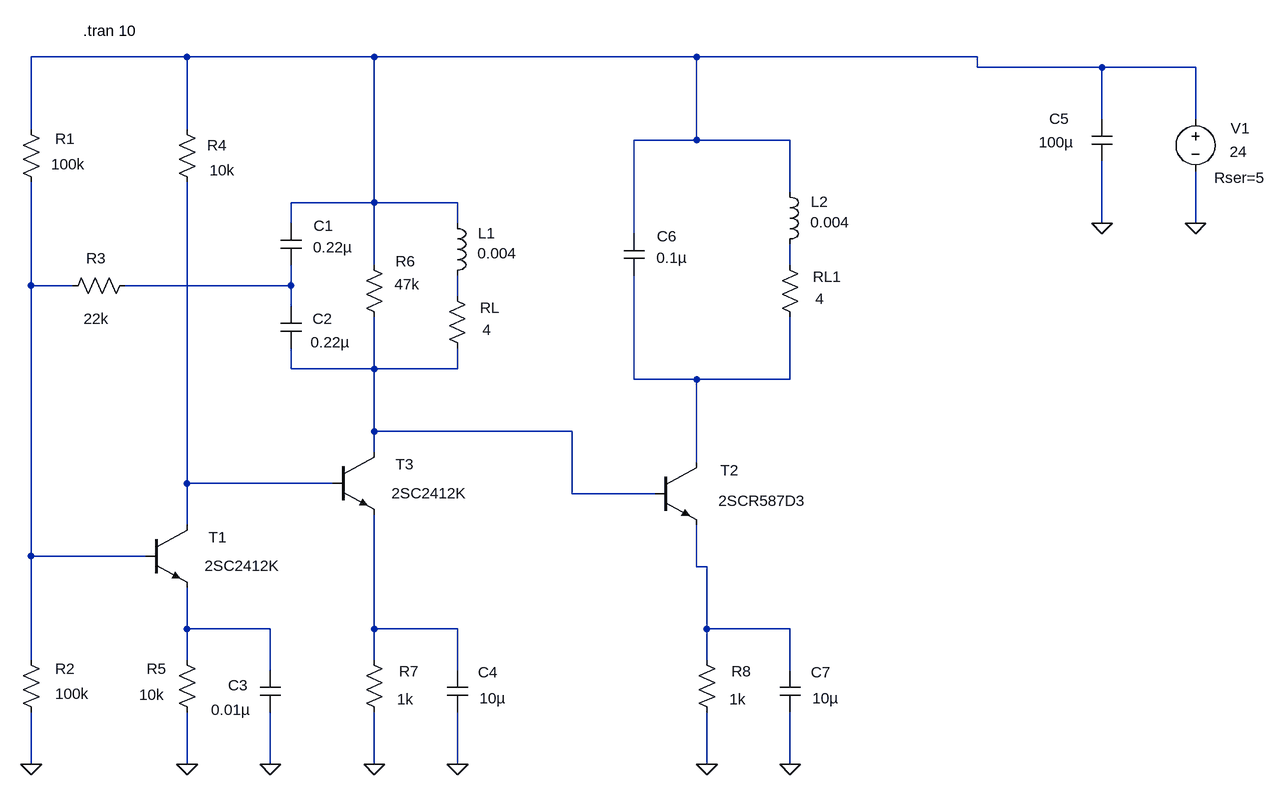
[diagram p0: schematic LC_OscillatorCapsFeedback2.asc]
LC_OscillatorCapsFeedback2.asc, the LTspice schematic file:
Version 4
SHEET 1 1236 820
WIRE -432 -288 -672 -288
WIRE -144 -288 -432 -288
WIRE 352 -288 -144 -288
WIRE 784 -288 352 -288
WIRE 784 -272 784 -288
WIRE 976 -272 784 -272
WIRE 1120 -272 976 -272
WIRE 976 -192 976 -272
WIRE 1120 -192 1120 -272
WIRE -672 -176 -672 -288
WIRE -432 -176 -432 -288
WIRE 352 -160 352 -288
WIRE 352 -160 256 -160
WIRE 496 -160 352 -160
WIRE 496 -80 496 -160
WIRE -144 -64 -144 -288
WIRE -144 -64 -272 -64
WIRE -16 -64 -144 -64
WIRE -272 -32 -272 -64
WIRE -16 -32 -16 -64
WIRE 976 -32 976 -128
WIRE 1120 -32 1120 -112
WIRE 256 -16 256 -160
WIRE -144 32 -144 -64
WIRE 496 32 496 0
WIRE -672 64 -672 -96
WIRE -608 64 -672 64
WIRE -272 64 -272 32
WIRE -272 64 -528 64
WIRE -16 80 -16 48
WIRE -272 96 -272 64
WIRE -272 192 -272 160
WIRE -144 192 -144 112
WIRE -144 192 -272 192
WIRE -16 192 -16 160
WIRE -16 192 -144 192
WIRE 256 208 256 48
WIRE 352 208 256 208
WIRE 496 208 496 112
WIRE 496 208 352 208
WIRE -144 288 -144 192
WIRE 160 288 -144 288
WIRE -144 320 -144 288
WIRE 352 336 352 208
WIRE -432 368 -432 -96
WIRE -208 368 -432 368
WIRE 160 384 160 288
WIRE 288 384 160 384
WIRE -432 432 -432 368
WIRE -672 480 -672 64
WIRE -496 480 -672 480
WIRE 352 496 352 432
WIRE 368 496 352 496
WIRE -432 592 -432 528
WIRE -304 592 -432 592
WIRE -144 592 -144 416
WIRE -16 592 -144 592
WIRE 368 592 368 496
WIRE 496 592 368 592
WIRE -672 640 -672 480
WIRE -432 640 -432 592
WIRE -144 640 -144 592
WIRE 368 640 368 592
WIRE -304 656 -304 592
WIRE -16 656 -16 592
WIRE 496 656 496 592
WIRE -672 800 -672 720
WIRE -432 800 -432 720
WIRE -304 800 -304 720
WIRE -144 800 -144 720
WIRE -16 800 -16 720
WIRE 368 800 368 720
WIRE 496 800 496 720
FLAG -144 800 0
FLAG -16 800 0
FLAG 1120 -32 0
FLAG -432 800 0
FLAG -672 800 0
FLAG 976 -32 0
FLAG -304 800 0
FLAG 368 800 0
FLAG 496 800 0
SYMBOL ind -32 -48 R0
WINDOW 0 48 31 Left 2
WINDOW 3 47 62 Left 2
SYMATTR InstName L1
SYMATTR Value 0.004
SYMBOL res -32 64 R0
WINDOW 0 51 34 Left 2
WINDOW 3 55 68 Left 2
SYMATTR InstName RL
SYMATTR Value 4
SYMBOL cap -288 -32 R0
WINDOW 0 51 4 Left 2
WINDOW 3 50 37 Left 2
SYMATTR InstName C1
SYMATTR Value 0.22µ
SYMBOL cap -288 96 R0
WINDOW 0 49 19 Left 2
WINDOW 3 46 55 Left 2
SYMATTR InstName C2
SYMATTR Value 0.22µ
SYMBOL npn 288 336 R0
WINDOW 0 101 12 Left 2
WINDOW 3 98 59 Left 2
SYMATTR InstName T2
SYMATTR Value 2SCR587D3
SYMBOL res -160 624 R0
WINDOW 0 54 33 Left 2
WINDOW 3 51 76 Left 2
SYMATTR InstName R7
SYMATTR Value 1k
SYMBOL cap -32 656 R0
WINDOW 0 48 3 Left 2
WINDOW 3 50 43 Left 2
SYMATTR InstName C4
SYMATTR Value 10µ
SYMBOL res -448 -192 R0
WINDOW 0 47 40 Left 2
WINDOW 3 51 78 Left 2
SYMATTR InstName R4
SYMATTR Value 10k
SYMBOL voltage 1120 -208 R0
WINDOW 0 54 30 Left 2
WINDOW 3 53 66 Left 2
WINDOW 123 0 0 Left 0
WINDOW 39 29 106 Left 2
SYMATTR InstName V1
SYMATTR Value 24
SYMATTR SpiceLine Rser=5
SYMBOL npn -496 432 R0
WINDOW 0 97 19 Left 2
WINDOW 3 91 63 Left 2
SYMATTR InstName T1
SYMATTR Value 2SC2412K
SYMBOL res -448 624 R0
WINDOW 0 -46 29 Left 2
WINDOW 3 -58 69 Left 2
SYMATTR InstName R5
SYMATTR Value 10k
SYMBOL res -688 -192 R0
WINDOW 0 53 30 Left 2
WINDOW 3 47 69 Left 2
SYMATTR InstName R1
SYMATTR Value 100k
SYMBOL res -688 624 R0
WINDOW 0 53 29 Left 2
WINDOW 3 53 68 Left 2
SYMATTR InstName R2
SYMATTR Value 100k
SYMBOL cap 960 -192 R0
WINDOW 0 -65 -1 Left 2
WINDOW 3 -81 35 Left 2
SYMATTR InstName C5
SYMATTR Value 100µ
SYMBOL res -512 48 R90
WINDOW 0 -11 60 VBottom 2
WINDOW 3 51 60 VTop 2
SYMATTR InstName R3
SYMATTR Value 22k
SYMBOL res -160 16 R0
WINDOW 0 49 10 Left 2
WINDOW 3 47 46 Left 2
SYMATTR InstName R6
SYMATTR Value 47k
SYMBOL cap -320 656 R0
WINDOW 0 -49 23 Left 2
WINDOW 3 -75 60 Left 2
SYMATTR InstName C3
SYMATTR Value 0.01µ
SYMBOL ind 480 -96 R0
WINDOW 0 48 31 Left 2
WINDOW 3 47 62 Left 2
SYMATTR InstName L2
SYMATTR Value 0.004
SYMBOL res 480 16 R0
WINDOW 0 51 34 Left 2
WINDOW 3 55 68 Left 2
SYMATTR InstName RL1
SYMATTR Value 4
SYMBOL cap 240 -16 R0
WINDOW 0 51 4 Left 2
WINDOW 3 50 37 Left 2
SYMATTR InstName C6
SYMATTR Value 0.1µ
SYMBOL res 352 624 R0
WINDOW 0 54 33 Left 2
WINDOW 3 51 76 Left 2
SYMATTR InstName R8
SYMATTR Value 1k
SYMBOL cap 480 656 R0
WINDOW 0 48 3 Left 2
WINDOW 3 50 43 Left 2
SYMATTR InstName C7
SYMATTR Value 10µ
SYMBOL npn -208 320 R0
WINDOW 0 97 19 Left 2
WINDOW 3 91 63 Left 2
SYMATTR InstName T3
SYMATTR Value 2SC2412K
TEXT -592 -328 Left 2 !.tran 10

The netlist it stands for:
* LC_OscillatorCapsFeedback2.asc
L1 N001 N005 0.004
RL N005 N006 4
C1 N001 N004 0.22µ
C2 N004 N006 0.22µ
Q§T2 N007 N006 N009 0 2SCR587D3
R7 N011 0 1k
C4 N011 0 10µ
R4 N001 N008 10k
V1 N001 0 24 Rser=5
Q§T1 N008 N003 N010 0 2SC2412K
R5 N010 0 10k
R1 N001 N003 100k
R2 N003 0 100k
C5 N001 0 100µ
R3 N004 N003 22k
R6 N001 N006 47k
C3 N010 0 0.01µ
L2 N001 N002 0.004
RL1 N002 N007 4
C6 N001 N007 0.1µ
R8 N009 0 1k
C7 N009 0 10µ
Q§T3 N006 N008 N011 0 2SC2412K
.model NPN NPN
.model PNP PNP
.lib standard.bjt
.tran 10
.backanno
.end